# EAGLE design TM4C123GH6PM (EAGLE 6.5.0)
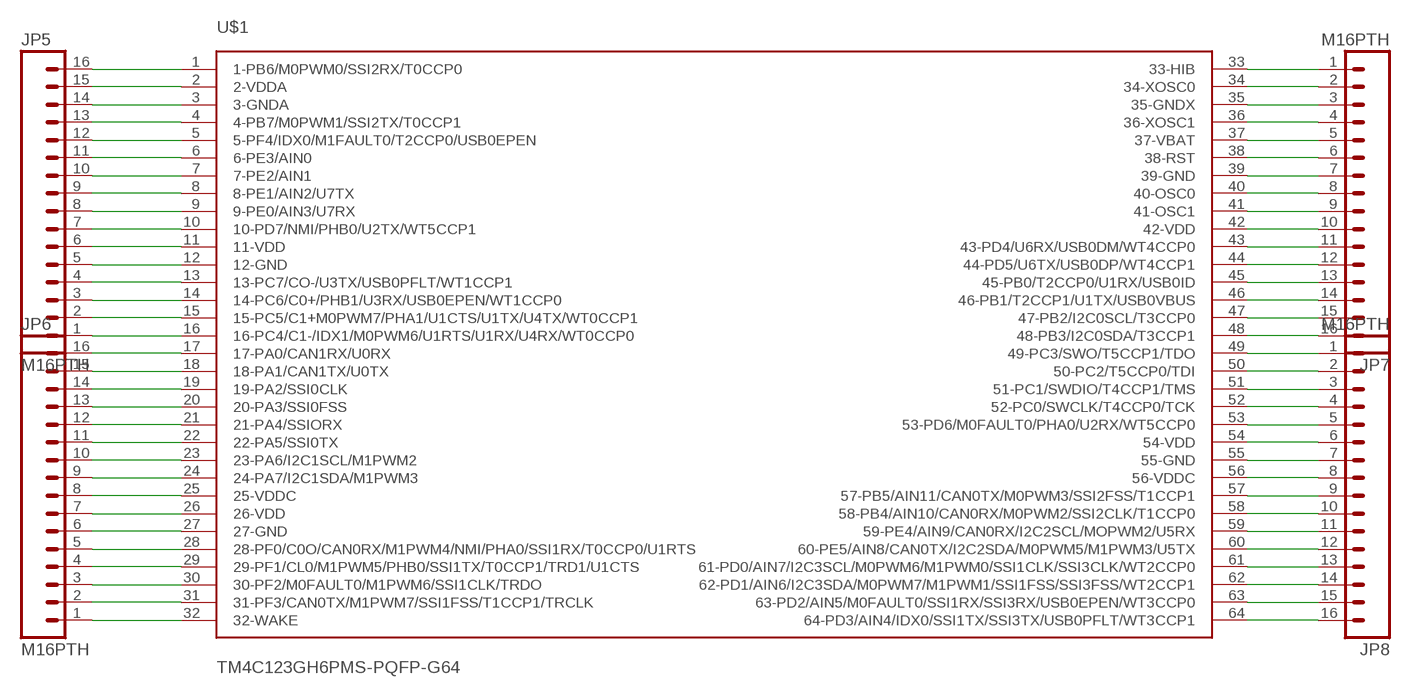
[diagram p0: schematic, sheet 1]

## Parts
JP5  M16PTH  [1X16]
JP6  M16PTH  [1X16]
JP7  M16PTH  [1X16]
JP8  M16PTH  [1X16]
U$1  TM4C123GH6PMS-PQFP-G64  [LQFP]

## Nets
N$1: JP5.16 U$1.1(1-PB6/M0PWM0/SSI2RX/T0CCP0)
N$2: JP5.15 U$1.2(2-VDDA)
N$3: JP5.14 U$1.3(3-GNDA)
N$4: JP5.13 U$1.4(4-PB7/M0PWM1/SSI2TX/T0CCP1)
N$5: JP5.12 U$1.5(5-PF4/IDX0/M1FAULT0/T2CCP0/USB0EPEN)
N$6: JP5.11 U$1.6(6-PE3/AIN0)
N$7: JP5.10 U$1.7(7-PE2/AIN1)
N$8: JP5.9 U$1.8(8-PE1/AIN2/U7TX)
N$9: JP5.8 U$1.9(9-PE0/AIN3/U7RX)
N$10: JP5.7 U$1.10(10-PD7/NMI/PHB0/U2TX/WT5CCP1)
N$11: JP5.6 U$1.11(11-VDD)
N$12: JP5.5 U$1.12(12-GND)
N$13: JP5.4 U$1.13(13-PC7/CO-/U3TX/USB0PFLT/WT1CCP1)
N$14: JP5.3 U$1.14(14-PC6/C0+/PHB1/U3RX/USB0EPEN/WT1CCP0)
N$15: JP5.2 U$1.15(15-PC5/C1+M0PWM7/PHA1/U1CTS/U1TX/U4TX/WT0CCP1)
N$16: JP5.1 U$1.16(16-PC4/C1-/IDX1/M0PWM6/U1RTS/U1RX/U4RX/WT0CCP0)
N$17: JP6.16 U$1.17(17-PA0/CAN1RX/U0RX)
N$18: JP6.15 U$1.18(18-PA1/CAN1TX/U0TX)
N$19: JP6.14 U$1.19(19-PA2/SSI0CLK)
N$20: JP6.13 U$1.20(20-PA3/SSI0FSS)
N$21: JP6.12 U$1.21(21-PA4/SSIORX)
N$22: JP6.11 U$1.22(22-PA5/SSI0TX)
N$23: JP6.10 U$1.23(23-PA6/I2C1SCL/M1PWM2)
N$24: JP6.9 U$1.24(24-PA7/I2C1SDA/M1PWM3)
N$25: JP6.8 U$1.25(25-VDDC)
N$26: JP6.7 U$1.26(26-VDD)
N$27: JP6.6 U$1.27(27-GND)
N$28: JP6.5 U$1.28(28-PF0/C0O/CAN0RX/M1PWM4/NMI/PHA0/SSI1RX/T0CCP0/U1RTS)
N$29: JP6.4 U$1.29(29-PF1/CL0/M1PWM5/PHB0/SSI1TX/T0CCP1/TRD1/U1CTS)
N$30: JP6.3 U$1.30(30-PF2/M0FAULT0/M1PWM6/SSI1CLK/TRDO)
N$31: JP6.2 U$1.31(31-PF3/CAN0TX/M1PWM7/SSI1FSS/T1CCP1/TRCLK)
N$32: JP6.1 U$1.32(32-WAKE)
N$33: JP7.1 U$1.33(33-HIB)
N$34: JP7.2 U$1.34(34-XOSC0)
N$35: JP7.3 U$1.35(35-GNDX)
N$36: JP7.4 U$1.36(36-XOSC1)
N$37: JP7.5 U$1.37(37-VBAT)
N$38: JP7.6 U$1.38(38-RST)
N$39: JP7.7 U$1.39(39-GND)
N$40: JP7.8 U$1.40(40-OSC0)
N$41: JP7.9 U$1.41(41-OSC1)
N$42: JP7.10 U$1.42(42-VDD)
N$43: JP7.11 U$1.43(43-PD4/U6RX/USB0DM/WT4CCP0)
N$44: JP7.12 U$1.44(44-PD5/U6TX/USB0DP/WT4CCP1)
N$45: JP7.13 U$1.45(45-PB0/T2CCP0/U1RX/USB0ID)
N$46: JP7.14 U$1.46(46-PB1/T2CCP1/U1TX/USB0VBUS)
N$47: JP7.15 U$1.47(47-PB2/I2C0SCL/T3CCP0)
N$48: JP7.16 U$1.48(48-PB3/I2C0SDA/T3CCP1)
N$49: JP8.1 U$1.49(49-PC3/SWO/T5CCP1/TDO)
N$50: JP8.2 U$1.50(50-PC2/T5CCP0/TDI)
N$51: JP8.3 U$1.51(51-PC1/SWDIO/T4CCP1/TMS)
N$52: JP8.4 U$1.52(52-PC0/SWCLK/T4CCP0/TCK)
N$53: JP8.5 U$1.53(53-PD6/M0FAULT0/PHA0/U2RX/WT5CCP0)
N$54: JP8.6 U$1.54(54-VDD)
N$55: JP8.7 U$1.55(55-GND)
N$56: JP8.8 U$1.56(56-VDDC)
N$57: JP8.9 U$1.57(57-PB5/AIN11/CAN0TX/M0PWM3/SSI2FSS/T1CCP1)
N$58: JP8.10 U$1.58(58-PB4/AIN10/CAN0RX/M0PWM2/SSI2CLK/T1CCP0)
N$59: JP8.11 U$1.59(59-PE4/AIN9/CAN0RX/I2C2SCL/MOPWM2/U5RX)
N$60: JP8.12 U$1.60(60-PE5/AIN8/CAN0TX/I2C2SDA/M0PWM5/M1PWM3/U5TX)
N$61: JP8.13 U$1.61(61-PD0/AIN7/I2C3SCL/M0PWM6/M1PWM0/SSI1CLK/SSI3CLK/WT2CCP0)
N$62: JP8.14 U$1.62(62-PD1/AIN6/I2C3SDA/M0PWM7/M1PWM1/SSI1FSS/SSI3FSS/WT2CCP1)
N$63: JP8.15 U$1.63(63-PD2/AIN5/M0FAULT0/SSI1RX/SSI3RX/USB0EPEN/WT3CCP0)
N$64: JP8.16 U$1.64(64-PD3/AIN4/IDX0/SSI1TX/SSI3TX/USB0PFLT/WT3CCP1)

## Library data of the parts
JP5-JP8 = SparkFun-Connectors:M16: 1x16 .1" header
U$1 = TM4C123GH6PM:TM4C123GH6PM

## Board
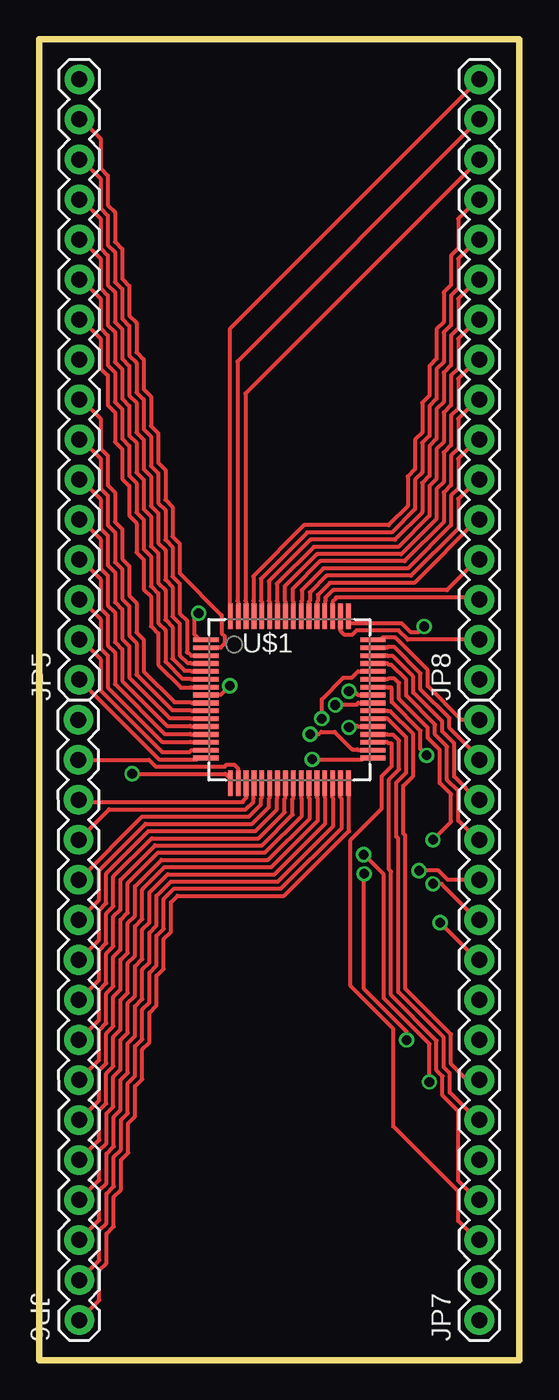
[diagram p1: board, top side]
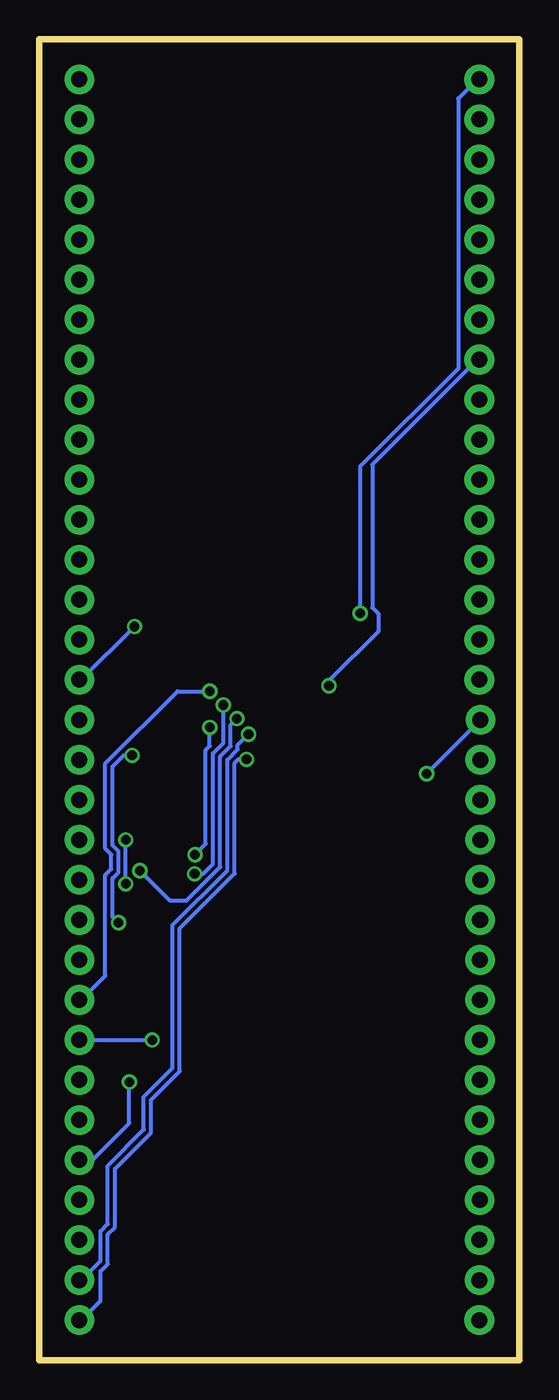
[diagram p2: board, bottom side, seen from below]

Size 30.48 x 83.82 mm. Coordinates in mm from the lower left corner, seen from the top.
Outline: 0,0 0,83.82 30.48,83.82 30.48,0 0,0
Copper layers (1*16): Top 0.0356mm / dielectric 1.5011mm / Bottom 0.0356mm
Design rules "OSHParkPCBOrder": minimum track width 6mil, minimum drill 13mil, track to track 6mil, track to pad 6mil, pad to pad 6mil, via to via 6mil, smd to smd 6mil, copper to edge 15mil, drill to drill 6mil, minimum pad ring 7mil, minimum via ring 7mil, stop-mask expansion 3mil, vias tented up to drill 0mil, thermal gap 10mil

### Footprints (pad centres in the part's own frame; a part is rotated, then mirrored left to right if it is on the bottom)
1X16 = drill 1.016 pad 1.88: 1 0,0; 2 2.54,0; 3 5.08,0; 4 7.62,0; 5 10.16,0; 6 12.7,0; 7 15.24,0; 8 17.78,0; 9 20.32,0; 10 22.86,0; 11 25.4,0; 12 27.94,0; 13 30.48,0; 14 33.02,0; 15 35.56,0; 16 38.1,0
LQFP = smd 1.6 x 0.3: 1 -5.3,3.8; 2 -5.3,3.3; 3 -5.3,2.8; 4 -5.3,2.3; 5 -5.3,1.8; 6 -5.3,1.3; 7 -5.3,0.8; 8 -5.3,0.3; 9 -5.3,-0.2; 10 -5.3,-0.7; 11 -5.3,-1.2; 12 -5.3,-1.7; 13 -5.3,-2.2; 14 -5.3,-2.7; 15 -5.3,-3.2; 16 -5.3,-3.7; 33 5.3,-3.7; 34 5.3,-3.2; 35 5.3,-2.7; 36 5.3,-2.2; 37 5.3,-1.7; 38 5.3,-1.2; 39 5.3,-0.7; 40 5.3,-0.2; 41 5.3,0.3; 42 5.3,0.8; 43 5.3,1.3; 44 5.3,1.8; 45 5.3,2.3; 46 5.3,2.8; 47 5.3,3.3; 48 5.3,3.8 | smd 0.3 x 1.6: 17 -3.75,-5.3; 18 -3.25,-5.3; 19 -2.75,-5.3; 20 -2.25,-5.3; 21 -1.75,-5.3; 22 -1.25,-5.3; 23 -0.75,-5.3; 24 -0.25,-5.3; 25 0.25,-5.3; 26 0.75,-5.3; 27 1.25,-5.3; 28 1.75,-5.3; 29 2.25,-5.3; 30 2.75,-5.3; 31 3.25,-5.3; 32 3.75,-5.3; 49 3.75,5.3; 50 3.25,5.3; 51 2.75,5.3; 52 2.25,5.3; 53 1.75,5.3; 54 1.25,5.3; 55 0.75,5.3; 56 0.25,5.3; 57 -0.25,5.3; 58 -0.75,5.3; 59 -1.25,5.3; 60 -1.75,5.3; 61 -2.25,5.3; 62 -2.75,5.3; 63 -3.25,5.3; 64 -3.75,5.3

### Placement (x,y rotation side)
JP5  2.54,43.18 90 top
JP6  2.54,2.54 90.1 top
JP7  27.94,2.54 90 top
JP8  27.94,43.18 90 top
U$1  15.88,41.91 0 top

### Tracks (layer width: path | path; a pad name or v marks a point on that pad's centre or on a via)
N$1  (via drill 0.61)
  Top 0.254: v10.11,47.4 9.83,47.12 9.83,46.08 10.19,45.72 U$1.1
  Bottom 0.254: v10.11,47.4 10.11,56.72 3.89,62.94 3.89,80.06 2.67,81.28 JP5.16
N$2
  Top 0.254: JP5.15 2.67,78.74 3.89,77.52 3.89,75.64 4.34,75.18 4.34,73.3 4.8,72.85 4.8,70.97 5.26,70.51 5.26,68.63 5.71,68.17 5.71,66.29 6.17,65.84 6.17,63.96 6.63,63.5 6.63,61.62 7.09,61.16 7.09,59.28 7.54,58.83 7.54,56.95 8,56.49 8,54.61 8.46,54.15 8.46,52.27 8.91,51.82 8.91,49.94 11.58,47.27 11.58,46.13 11.76,45.95 11.76,45.47 11.51,45.21 10.59,45.21 U$1.2
N$3
  Top 0.254: JP5.14 2.67,76.2 3.89,74.98 3.89,73.1 4.34,72.64 4.34,70.76 4.8,70.31 4.8,68.43 5.26,67.97 5.26,66.09 5.71,65.63 5.71,63.75 6.17,63.3 6.17,61.42 6.63,60.96 6.63,59.08 7.09,58.62 7.09,56.74 7.54,56.29 7.54,54.41 8,53.95 8,52.07 8.46,51.61 8.46,49.73 8.91,49.28 8.91,47.4 9.37,46.94 9.37,44.93 9.4,44.91 9.45,44.91 9.65,44.7 U$1.3
N$4
  Top 0.254: JP5.13 2.67,73.66 3.89,72.44 3.89,70.56 4.34,70.1 4.34,68.22 4.8,67.77 4.8,65.89 5.26,65.43 5.26,63.55 5.71,63.09 5.71,61.21 6.17,60.76 6.17,58.88 6.63,58.42 6.63,56.54 7.09,56.08 7.09,54.2 7.54,53.75 7.54,51.87 8,51.41 8,49.53 8.46,49.07 8.46,47.19 8.91,46.74 8.91,44.73 9.4,44.25 9.6,44.25 9.63,44.22 U$1.4
N$5
  Top 0.254: JP5.12 2.67,71.12 3.89,69.9 3.89,68.02 4.34,67.56 4.34,65.68 4.8,65.23 4.8,63.35 5.26,62.89 5.26,61.01 5.71,60.55 5.71,58.67 6.17,58.22 6.17,56.34 6.63,55.88 6.63,54 7.09,53.54 7.09,51.66 7.54,51.21 7.54,49.33 8,48.87 8,46.99 8.46,46.53 8.46,44.53 9.22,43.76 9.6,43.76 9.65,43.71 U$1.5
N$6
  Top 0.254: JP5.11 2.67,68.58 3.89,67.36 3.89,65.48 4.34,65.02 4.34,63.14 4.8,62.69 4.8,60.81 5.26,60.35 5.26,58.47 5.71,58.01 5.71,56.13 6.17,55.68 6.17,53.8 6.63,53.34 6.63,51.46 7.09,51 7.09,49.12 7.54,48.67 7.54,46.79 8,46.33 8,44.32 9.07,43.26 9.6,43.26 9.65,43.2 U$1.6
N$7
  Top 0.254: JP5.10 2.67,66.04 3.89,64.82 3.89,62.94 4.34,62.48 4.34,60.6 4.8,60.15 4.8,58.27 5.26,57.81 5.26,55.93 5.71,55.47 5.71,53.59 6.17,53.14 6.17,51.26 6.63,50.8 6.63,48.92 7.09,48.46 7.09,46.58 7.54,46.13 7.54,44.12 8.99,42.67 9.6,42.67 9.63,42.7 10.57,42.7 U$1.7
N$8  (via drill 0.61)
  Top 0.254: v12.09,42.8 11.51,42.22 10.59,42.22 U$1.8
  Bottom 0.254: v12.09,42.8 12.09,43.13 8.97,46.25 8.97,47.37 9.35,47.75 9.35,56.82 2.67,63.5 JP5.9
N$9
  Top 0.254: JP5.8 2.67,60.96 3.89,59.74 3.89,57.86 4.34,57.4 4.34,55.52 4.8,55.07 4.8,53.19 5.26,52.73 5.26,50.85 5.71,50.39 5.71,48.51 6.17,48.06 6.17,46.18 6.63,45.72 6.63,43.71 8.59,41.76 9.6,41.76 9.65,41.71 U$1.9
N$10
  Top 0.254: JP5.7 2.67,58.42 3.89,57.2 3.89,55.32 4.34,54.86 4.34,52.98 4.8,52.53 4.8,50.65 5.26,50.19 5.26,48.31 5.71,47.85 5.71,45.97 6.17,45.52 6.17,43.51 8.43,41.25 9.6,41.25 9.65,41.2 10.57,41.2 U$1.10
N$11
  Top 0.254: JP5.6 2.67,55.88 3.89,54.66 3.89,52.78 4.34,52.32 4.34,50.44 4.8,49.99 4.8,48.11 5.26,47.65 5.26,45.77 5.71,45.31 5.71,43.31 8.28,40.74 9.6,40.74 9.63,40.72 U$1.11
N$12
  Top 0.254: JP5.5 2.67,53.34 3.89,52.12 3.89,50.24 4.34,49.78 4.34,47.9 4.8,47.45 4.8,45.57 5.26,45.11 5.26,43.1 8.1,40.26 9.6,40.26 9.65,40.21 U$1.12
N$13
  Top 0.254: JP5.4 2.67,50.8 3.89,49.58 3.89,47.7 4.34,47.24 4.34,45.36 4.8,44.91 4.8,42.9 7.95,39.75 9.6,39.75 9.65,39.7 U$1.13
N$14
  Top 0.254: JP5.3 2.67,48.26 3.89,47.04 3.89,45.16 4.34,44.7 4.34,42.7 7.8,39.24 9.6,39.24 9.63,39.22 U$1.14
N$15
  Top 0.254: JP5.2 2.67,45.72 3.89,44.5 3.89,42.49 7.8,38.58 9.53,38.58 9.65,38.71 U$1.15
N$16
  Top 0.254: JP5.1 7.59,38.12 10.01,38.12 10.08,38.2 U$1.16
N$17  (via drill 0.61)
  Top 0.254: v5.89,37.21 11.81,37.21 12.12,36.91 12.12,36.63 U$1.17
  Bottom 0.254: v5.89,37.21 2.49,40.62 JP6.16
N$18
  Top 0.254: U$1.18 12.62,36.63 12.62,37.54 12.37,37.8 11.89,37.8 11.76,37.67 7.39,37.67 6.96,38.1 JP6.15
N$19
  Top 0.254: U$1.19 13.13,36.6 13.13,35.69 12.93,35.48 12.93,35.43 12.9,35.41 2.62,35.41 2.49,35.53 JP6.14
N$20
  Top 0.254: U$1.20 13.61,35.66 13.59,35.64 13.59,35.43 13.11,34.95 4.42,34.95 JP6.13
N$21
  Top 0.254: U$1.21 14.12,35.69 14.07,35.64 14.07,35.26 13.31,34.49 6.53,34.49 2.52,30.48 JP6.12
N$22
  Top 0.254: U$1.22 14.63,35.69 14.58,35.64 14.58,35.1 13.51,34.04 6.73,34.04 3.79,31.09 3.79,29.21 2.52,27.94 JP6.11
N$23
  Top 0.254: U$1.23 15.11,35.66 15.09,35.64 15.09,34.95 13.72,33.58 6.93,33.58 4.24,30.89 4.24,29.01 3.79,28.55 3.79,26.67 2.52,25.4 JP6.10
N$24
  Top 0.254: U$1.24 15.62,35.69 15.57,35.64 15.57,34.77 13.92,33.12 7.14,33.12 4.7,30.68 4.7,28.8 4.24,28.35 4.24,26.47 3.79,26.01 3.79,24.13 2.52,22.86 JP6.9
N$25
  Top 0.254: U$1.25 16.13,35.69 16.08,35.64 16.08,34.62 14.12,32.66 7.34,32.66 5.16,30.48 5.16,28.6 4.7,28.14 4.7,26.26 4.24,25.81 4.24,23.93 3.79,23.47 3.79,21.59 JP6.8
N$26
  Top 0.254: U$1.26 16.64,36.6 16.64,35.66 16.66,35.64 16.66,34.54 14.33,32.21 7.54,32.21 5.61,30.28 5.61,28.4 5.16,27.94 5.16,26.06 4.7,25.6 4.7,23.72 4.24,23.27 4.24,21.39 3.79,20.93 3.79,19.05 JP6.7
N$27
  Top 0.254: U$1.27 17.12,35.69 17.17,35.64 17.17,34.39 14.53,31.75 7.75,31.75 6.07,30.07 6.07,28.19 5.61,27.74 5.61,25.86 5.16,25.4 5.16,23.52 4.7,23.06 4.7,21.18 4.24,20.73 4.24,18.85 3.79,18.39 3.79,16.48 2.54,15.24 JP6.6
N$28
  Top 0.254: U$1.28 17.63,35.69 17.68,35.64 17.68,34.24 14.73,31.29 7.95,31.29 6.53,29.87 6.53,27.99 6.07,27.53 6.07,25.65 5.61,25.2 5.61,23.32 5.16,22.86 5.16,20.98 4.7,20.52 4.7,18.64 4.24,18.19 4.24,16.28 3.81,15.85 3.81,13.97 2.54,12.7 JP6.5
N$29
  Top 0.254: U$1.29 18.14,36.6 18.14,35.66 18.16,35.64 18.16,34.06 14.94,30.84 8.15,30.84 6.99,29.67 6.99,27.79 6.53,27.33 6.53,25.45 6.07,24.99 6.07,23.11 5.61,22.66 5.61,20.78 5.16,20.32 5.16,18.44 4.7,17.98 4.7,16.08 4.27,15.65 4.27,13.77 3.81,13.31 3.81,11.43 JP6.4
N$30
  Top 0.254: U$1.30 18.62,35.69 18.67,35.64 18.67,33.91 15.14,30.38 8.36,30.38 7.44,29.46 7.44,27.58 6.99,27.13 6.99,25.25 6.53,24.79 6.53,22.91 6.07,22.45 6.07,20.57 5.61,20.12 5.61,18.24 5.16,17.78 5.16,15.88 4.72,15.44 4.72,13.56 4.27,13.11 4.27,11.23 3.81,10.77 3.81,8.89 JP6.3
N$31
  Top 0.254: U$1.31 19.13,35.69 19.2,35.61 19.2,33.78 15.34,29.92 8.56,29.92 7.9,29.26 7.9,27.38 7.44,26.92 7.44,25.04 6.99,24.59 6.99,22.71 6.53,22.25 6.53,20.37 6.07,19.91 6.07,18.03 5.61,17.58 5.61,15.67 5.18,15.24 5.18,13.36 4.72,12.9 4.72,11.02 4.27,10.57 4.27,8.69 3.81,8.23 3.81,6.35 JP6.2
N$32
  Top 0.254: JP6.1 3.81,3.81 3.81,5.69 4.27,6.15 4.27,8.03 4.72,8.48 4.72,10.36 5.18,10.82 5.18,12.7 5.64,13.16 5.64,15.04 6.07,15.47 6.07,17.37 6.53,17.83 6.53,19.71 6.99,20.17 6.99,22.05 7.44,22.5 7.44,24.38 7.9,24.84 7.9,26.72 8.36,27.18 8.36,29.06 8.76,29.46 15.54,29.46 19.66,33.58 19.66,36.02 19.63,36.04 19.63,36.6 U$1.32
N$33  (via drill 0.61)
  Top 0.254: v17.32,38.12 20.52,38.12 20.6,38.2 21.16,38.2 U$1.33
  Bottom 0.254: v17.32,38.12 17.86,38.12 18.09,37.9 18.09,30.89 21.57,27.41 21.57,18.34 23.39,16.51 23.39,14.43 25.68,12.14 25.68,8.43 26.14,7.98 26.14,6.1 26.59,5.64 26.59,3.76 27.81,2.54 JP7.1
N$34  (via drill 0.61)
  Top 0.254: v17.2,39.73 17.73,39.73 17.88,39.88 18.75,39.88 19.86,38.76 20.19,38.76 20.24,38.71 21.16,38.71 U$1.34
  Bottom 0.254: v17.2,39.73 17.88,39.04 17.88,38.76 18.54,38.1 18.54,31.09 22.02,27.61 22.02,18.54 23.85,16.71 23.85,14.63 26.14,12.34 26.14,8.64 26.59,8.18 26.59,6.3 27.81,5.08 JP7.2
N$35
  Top 0.254: JP7.3 27.81,7.62 26.59,8.84 26.59,10.72 22.48,14.83 22.48,21.03 19.76,23.75 19.76,33.02 21.74,35 21.74,37.06 22.38,37.69 22.38,39.12 22.35,39.14 22.17,39.14 22.1,39.22 U$1.35
N$36
  Top 0.254: JP7.4 27.81,10.16 26.59,11.38 26.59,15.8 25.6,16.79 25.6,18.01 25.22,18.39 25.22,20.27 22.33,23.16 22.33,31.01 22.2,31.14 22.2,36.85 22.84,37.49 22.84,39.32 22.48,39.67 22.15,39.67 22.12,39.7 U$1.36
N$37  (via drill 0.61)
  Top 0.254: v19.66,40.16 19.76,40.26 20.19,40.26 20.24,40.21 21.16,40.21 U$1.37 | v20.6,32.08 21.87,30.81 21.87,22.96 24.77,20.07 v24.77,17.65
  Bottom 0.254: v19.66,40.16 19.66,38.96 19.91,38.71 19.91,32.77 v20.6,32.08 | v24.77,17.65 24.77,15.04 27.1,12.7 JP7.5
N$38
  Top 0.254: JP7.6 27.81,15.24 26.06,16.99 26.06,18.21 25.68,18.59 25.68,20.47 22.78,23.37 22.78,33.1 22.66,33.22 22.66,36.65 23.29,37.29 23.29,39.52 22.1,40.72 U$1.38
N$39
  Top 0.254: JP7.7 27.15,17.78 26.14,18.8 26.14,20.68 23.24,23.57 23.24,33.3 23.11,33.43 23.11,36.45 23.75,37.08 23.75,39.73 22.3,41.17 22.15,41.17 22.12,41.2 21.18,41.2 U$1.39
N$40  (via drill 0.61)
  Top 0.254: v18.8,41.58 18.82,41.6 20.14,41.6 20.24,41.71 21.16,41.71 U$1.40 | v20.62,30.86 20.62,23.55 23.32,20.85 v23.32,20.32
  Bottom 0.254: v18.8,41.58 18.8,39.17 19.46,38.51 19.46,31.5 20.09,30.86 v20.62,30.86 | JP7.8 v23.32,20.32
N$41  (via drill 0.61)
  Top 0.254: v19.66,42.44 20.02,42.44 20.24,42.22 21.16,42.22 U$1.41
  Bottom 0.254: v19.66,42.44 21.72,42.44 26.29,37.87 26.29,32.46 25.91,32.08 25.91,31.17 26.29,30.79 26.29,24.38 27.81,22.86 JP7.9
N$42  (via drill 0.61)
  Top 0.254: v24.59,38.38 24.21,38.76 24.21,39.93 22.38,41.76 22.38,42.65 22.35,42.67 22.15,42.67 22.12,42.7 21.18,42.7 U$1.42 | v25.45,27.76 27.81,25.4 JP7.10
  Bottom 0.254: v24.59,38.38 25.12,38.38 25.83,37.67 25.83,32.66 25.45,32.28 25.45,30.96 25.83,30.58 25.83,28.14 v25.45,27.76
N$43  (via drill 0.61)
  Top 0.254: v24.99,33.02 26.14,34.16 26.14,35.92 25.43,36.63 25.43,38.73 24.66,39.5 24.66,40.13 22.84,41.96 22.84,42.98 22.55,43.26 22.15,43.26 22.1,43.2 U$1.43 | v24.99,30.23 25.53,30.23 27.81,27.94 JP7.11
  Bottom 0.254: v24.99,30.23 v24.99,33.02
N$44  (via drill 0.61)
  Top 0.254: v17.93,40.72 17.93,41.94 19.3,43.31 19.84,43.31 20.24,43.71 21.16,43.71 U$1.44 | v24.11,31.06 25.35,31.06 25.93,30.48 JP7.12
  Bottom 0.254: v17.93,40.72 18.34,40.31 18.34,38.96 19,38.3 19,31.29 21.13,29.16 22.2,29.16 v24.11,31.06
N$45
  Top 0.254: JP7.13 27.81,33.02 26.59,34.24 26.59,36.12 25.88,36.83 25.88,38.94 25.12,39.7 25.12,40.34 23.29,42.16 23.29,43.18 22.35,44.12 22.2,44.12 22.1,44.22 U$1.45
N$46
  Top 0.254: JP7.14 27.81,35.56 26.34,37.03 26.34,39.14 25.58,39.9 25.58,40.54 23.75,42.37 23.75,43.38 22.45,44.68 22.12,44.68 22.1,44.7 U$1.46
N$47
  Top 0.254: JP7.15 27.94,38.2 26.04,40.11 26.04,40.74 24.21,42.57 24.21,43.59 22.53,45.26 22.15,45.26 22.1,45.21 U$1.47
N$48
  Top 0.254: JP7.16 26.8,40.64 24.66,42.77 24.66,43.79 22.61,45.85 21.79,45.85 21.67,45.72 U$1.48
N$49  (via drill 0.61)
  Top 0.254: v24.43,46.56 24.05,46.18 23.6,46.18 23.01,46.76 19.79,46.76 19.63,46.91 19.63,47.19 U$1.49
  Bottom 0.254: v24.43,46.56 27.81,43.18 JP8.1
N$50
  Top 0.254: JP8.2 23.39,45.72 22.81,46.3 20.14,46.3 19.86,46.02 19.38,46.02 19.13,46.28 19.13,47.19 U$1.50
N$51
  Top 0.254: JP8.3 27.79,48.41 18.85,48.41 18.82,48.39 18.82,48.34 18.62,48.13 U$1.51
N$52
  Top 0.254: JP8.4 27.81,50.8 25.88,48.87 18.64,48.87 18.16,48.39 18.16,48.18 18.14,48.16 18.14,47.22 U$1.52
N$53
  Top 0.254: JP8.5 27.81,53.34 23.8,49.33 18.44,49.33 17.68,48.56 17.68,48.18 17.63,48.13 U$1.53
N$54
  Top 0.254: JP8.6 27.81,55.88 26.59,54.66 26.59,52.78 23.6,49.78 18.24,49.78 17.17,48.72 17.17,48.18 17.12,48.13 U$1.54
N$55
  Top 0.254: JP8.7 27.81,58.42 26.59,57.2 26.59,55.32 26.14,54.86 26.14,52.98 23.39,50.24 18.03,50.24 16.66,48.87 16.66,48.18 16.64,48.16 16.64,47.22 U$1.55
N$56
  Top 0.254: JP8.8 27.81,60.96 26.59,59.74 26.59,57.86 26.14,57.4 26.14,55.52 25.68,55.07 25.68,53.19 23.19,50.7 17.83,50.7 16.08,48.95 16.08,48.18 16.13,48.13 U$1.56
N$57
  Top 0.254: JP8.9 27.81,63.5 26.59,62.28 26.59,60.4 26.14,59.94 26.14,58.06 25.68,57.61 25.68,55.73 25.22,55.27 25.22,53.39 22.99,51.16 17.63,51.16 15.57,49.1 15.57,48.18 15.62,48.13 U$1.57
N$58
  Top 0.254: JP8.10 27.81,66.04 26.59,64.82 26.59,62.94 26.14,62.48 26.14,60.6 25.68,60.15 25.68,58.27 25.22,57.81 25.22,55.93 24.77,55.47 24.77,53.59 22.78,51.61 17.42,51.61 15.09,49.28 15.09,48.18 15.11,48.16 U$1.58
N$59
  Top 0.254: JP8.11 27.81,68.58 26.59,67.36 26.59,65.48 26.14,65.02 26.14,63.14 25.68,62.69 25.68,60.81 25.22,60.35 25.22,58.47 24.77,58.01 24.77,56.13 24.31,55.68 24.31,53.8 22.58,52.07 17.22,52.07 14.58,49.43 14.58,48.18 14.63,48.13 U$1.59
N$60
  Top 0.254: JP8.12 27.81,71.12 26.59,69.9 26.59,68.02 26.14,67.56 26.14,65.68 25.68,65.23 25.68,63.35 25.22,62.89 25.22,61.01 24.77,60.55 24.77,58.67 24.31,58.22 24.31,56.34 23.85,55.88 23.85,54 22.38,52.53 17.02,52.53 14.07,49.58 14.07,48.18 14.12,48.13 U$1.60
N$61
  Top 0.254: JP8.13 27.81,73.66 26.59,72.44 26.59,70.56 26.14,70.1 26.14,68.22 25.68,67.77 25.68,65.89 25.22,65.43 25.22,63.55 24.77,63.09 24.77,61.21 24.31,60.76 24.31,58.88 23.85,58.42 23.85,56.54 23.39,56.08 23.39,54.2 22.17,52.98 16.82,52.98 13.59,49.76 13.59,48.18 13.61,48.16 U$1.61
N$62
  Top 0.254: JP8.14 13.08,61.34 13.08,48.18 13.13,48.13 13.13,47.22 U$1.62
N$63
  Top 0.254: JP8.15 12.57,63.37 12.57,48.18 12.62,48.13 U$1.63
N$64
  Top 0.254: JP8.16 12.09,65.43 12.09,48.01 12.12,47.98 U$1.64

### Text on the board
tStop: 1 | 64 | 32 | 33